# Altium schematic sheet GameCube.SchDoc
size A; SheetNumber: 6; SheetTotal: 7
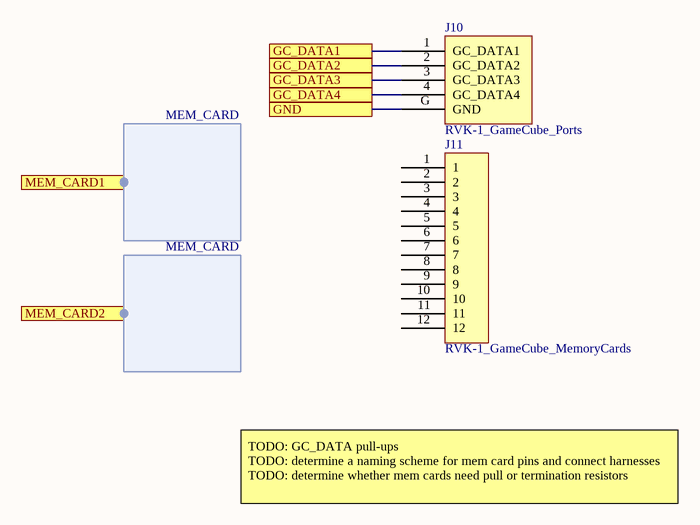
[diagram p0: GameCube.SchDoc]

## Parts
J10  RVK-1_GameCube_Ports  [RVK-1_GC_Controller_Vias]
J11  RVK-1_GameCube_MemoryCards  [RVK-1_MemCard_TestPoints]

## Ports
GC_DATA1, GC_DATA2, GC_DATA3, GC_DATA4, GND, MEM_CARD1 (harness MEM_CARD), MEM_CARD2 (harness MEM_CARD)

## Harnesses
MEM_CARD: 

## Nets
GC_DATA1: J10.1(GC_DATA1) ; port GC_DATA1
GC_DATA2: J10.2(GC_DATA2) ; port GC_DATA2
GC_DATA3: J10.3(GC_DATA3) ; port GC_DATA3
GC_DATA4: J10.4(GC_DATA4) ; port GC_DATA4
GND: J10.G(GND) ; port GND

Not connected (* = marked no-connect by the designer): J11 1 2 3 4 5 6 7 8 9 10 11 12

## Notes on the sheet
- TODO: GC_DATA pull-ups
  TODO: determine a naming scheme for mem card pins and connect harnesses
  TODO: determine whether mem cards need pull or termination resistors